# Altium project ATX_PowerUSB.PrjPcb
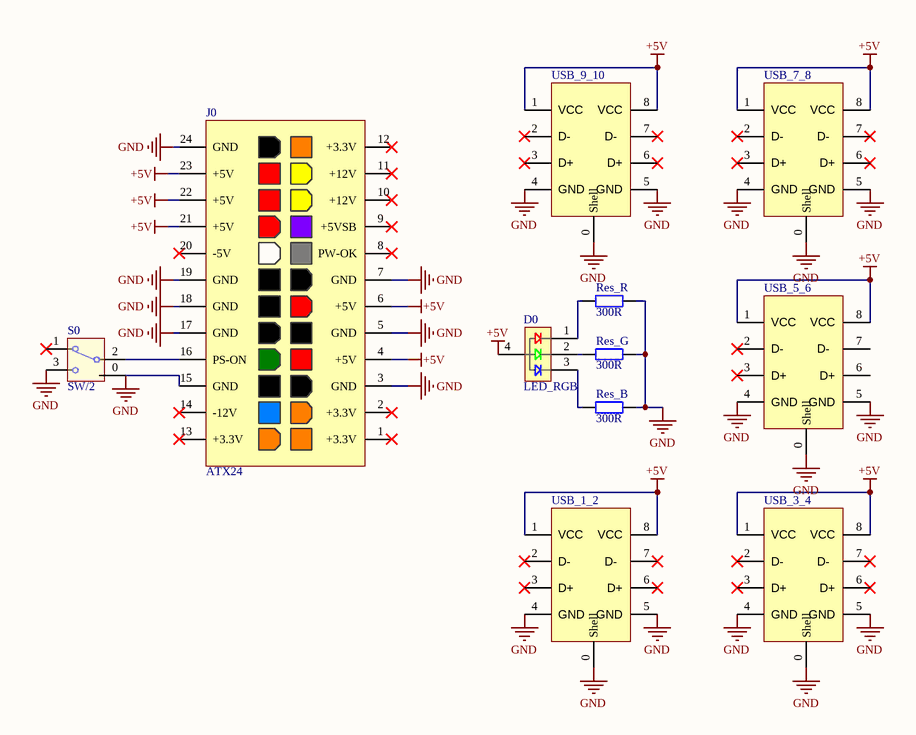
[diagram p0: Sheet.SchDoc]
1 sheet, 11 parts. Net scope: global (net labels, ports and power ports of the same name join across sheets).
Board file: PCB.PcbDoc

## Sheet Sheet.SchDoc
size A3

### Parts
D0  LED_RGB  [LED_RGB_0805]
J0  ATX24  [ATX24-5569]
Res_B  value 300R  [0805-1]  (hidden comment: Res1)
Res_G  value 300R  [0805-1]  (hidden comment: Res1)
Res_R  value 300R  [0805-1]  (hidden comment: Res1)
S0  SW/2  [SW/2_SIP3_H]
USB_1_2  USB-A_P/2  [USB-A_P/2]  (value not drawn)
USB_3_4  USB-A_P/2  [USB-A_P/2]  (value not drawn)
USB_5_6  USB-A_P/2  [USB-A_P/2]  (value not drawn)
USB_7_8  USB-A_P/2  [USB-A_P/2]  (value not drawn)
USB_9_10  USB-A_P/2  [USB-A_P/2]  (value not drawn)

### Nets
+5V: D0.4 J0.4(+5V) J0.6(+5V) J0.21(+5V) J0.22(+5V) J0.23(+5V) USB_1_2.1(VCC) USB_1_2.8(VCC) USB_3_4.1(VCC) USB_3_4.8(VCC) USB_5_6.1(VCC) USB_5_6.8(VCC) USB_7_8.1(VCC) USB_7_8.8(VCC) USB_9_10.1(VCC) USB_9_10.8(VCC)
GND: J0.3(GND) J0.5(GND) J0.7(GND) J0.15(GND) J0.17(GND) J0.18(GND) J0.19(GND) J0.24(GND) Res_B.1 Res_G.2 Res_R.1 S0.0 S0.3 USB_1_2.0(Shell) USB_1_2.4(GND) USB_1_2.5(GND) USB_3_4.0(Shell) USB_3_4.4(GND) USB_3_4.5(GND) USB_5_6.0(Shell) USB_5_6.4(GND) USB_5_6.5(GND) USB_7_8.0(Shell) USB_7_8.4(GND) USB_7_8.5(GND) USB_9_10.0(Shell) USB_9_10.4(GND) USB_9_10.5(GND)
NetD0_1: D0.1 Res_R.2
NetD0_2: D0.2 Res_G.1
NetD0_3: D0.3 Res_B.2
NetJ0_16: J0.16(PS-ON) S0.2

Not connected (* = marked no-connect by the designer): J0 1(+3.3V)* 2(+3.3V)* 8(PW-OK)* 9(+5VSB)* 10(+12V)* 11(+12V)* 12(+3.3V)* 13(+3.3V)* 14(-12V)* 20(-5V)*; S0 1*; USB_1_2 2(D-)* 3(D+)* 6(D+)* 7(D-)*; USB_3_4 2(D-)* 3(D+)* 6(D+)* 7(D-)*; USB_5_6 2(D-)* 3(D+)* 6(D+) 7(D-); USB_7_8 2(D-)* 3(D+)* 6(D+)* 7(D-)*; USB_9_10 2(D-)* 3(D+)* 6(D+)* 7(D-)*

### Library data of the parts
J0 = ATX24_5569: ATX24_5569 供电母座
Res_B Res_G Res_R = Res1: 贴片电阻; Published: 8-Jun-2000; LatestRevisionDate: 17-Jul-2002; LatestRevisionNote: Re-released for DXP Platform.; PackageReference: AXIAL-0.4; Publisher: Altium Limited
S0 = SW/2: 2档拨动开关
USB_1_2 USB_3_4 USB_5_6 USB_7_8 USB_9_10 = USB-A_P/2: USB-A 双层 180度 母座